# Altium schematic sheet loom-rear-new.SchDoc
size 840 x 594 mm
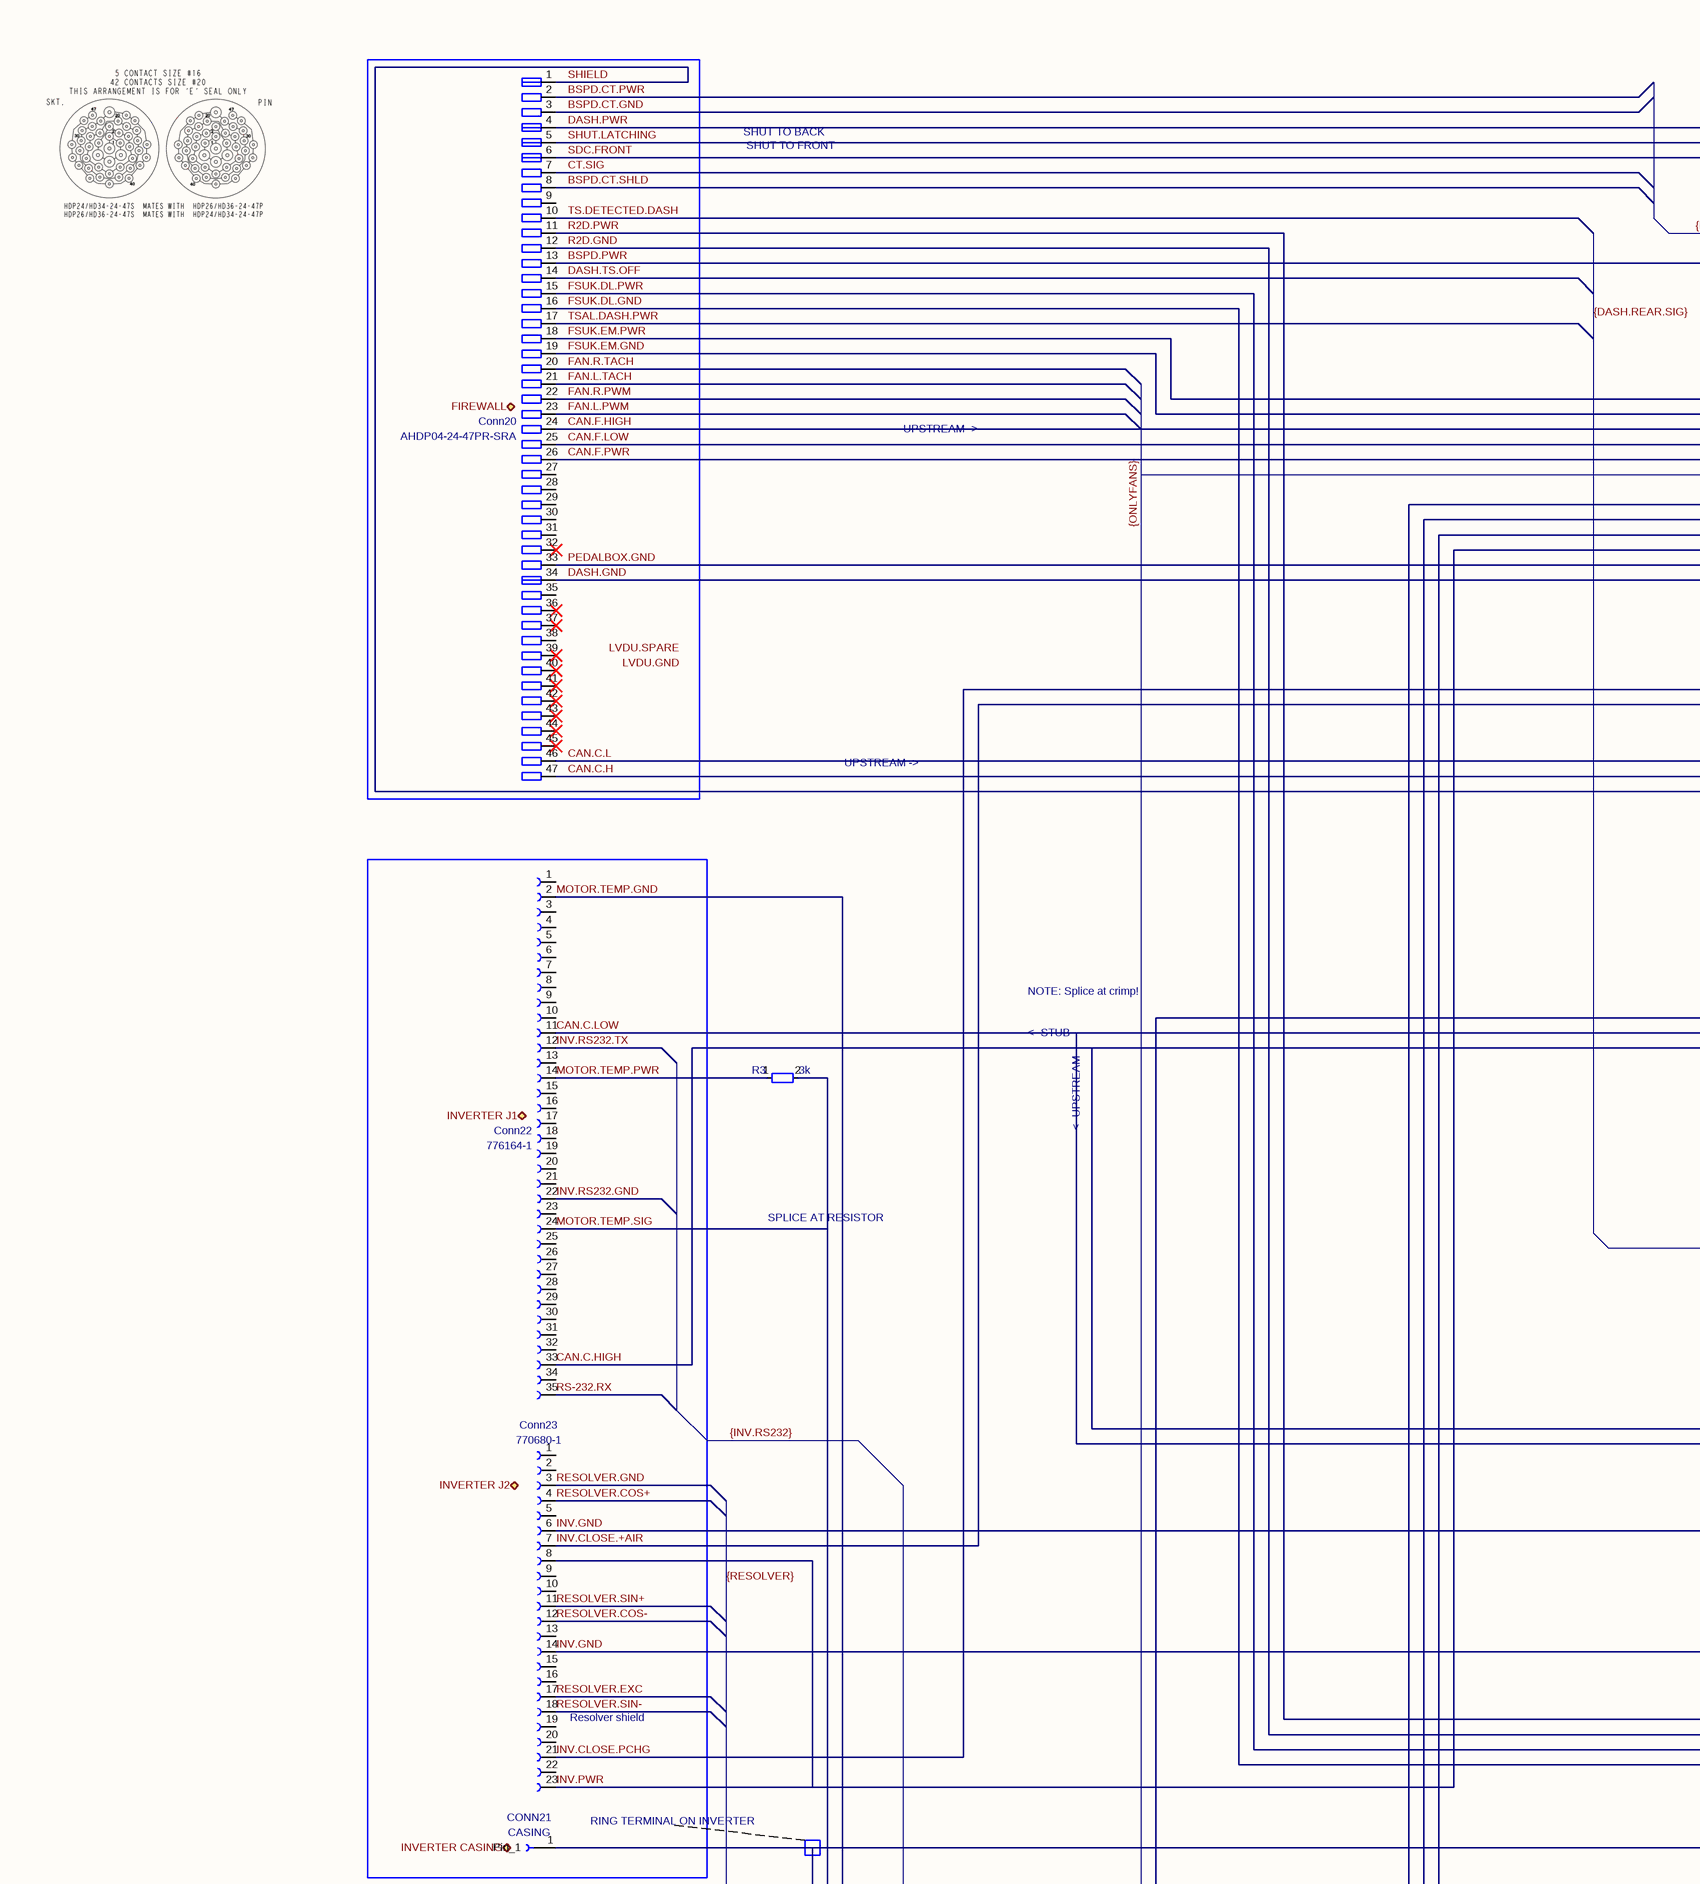
[diagram p0: loom-rear-new.SchDoc, top left]
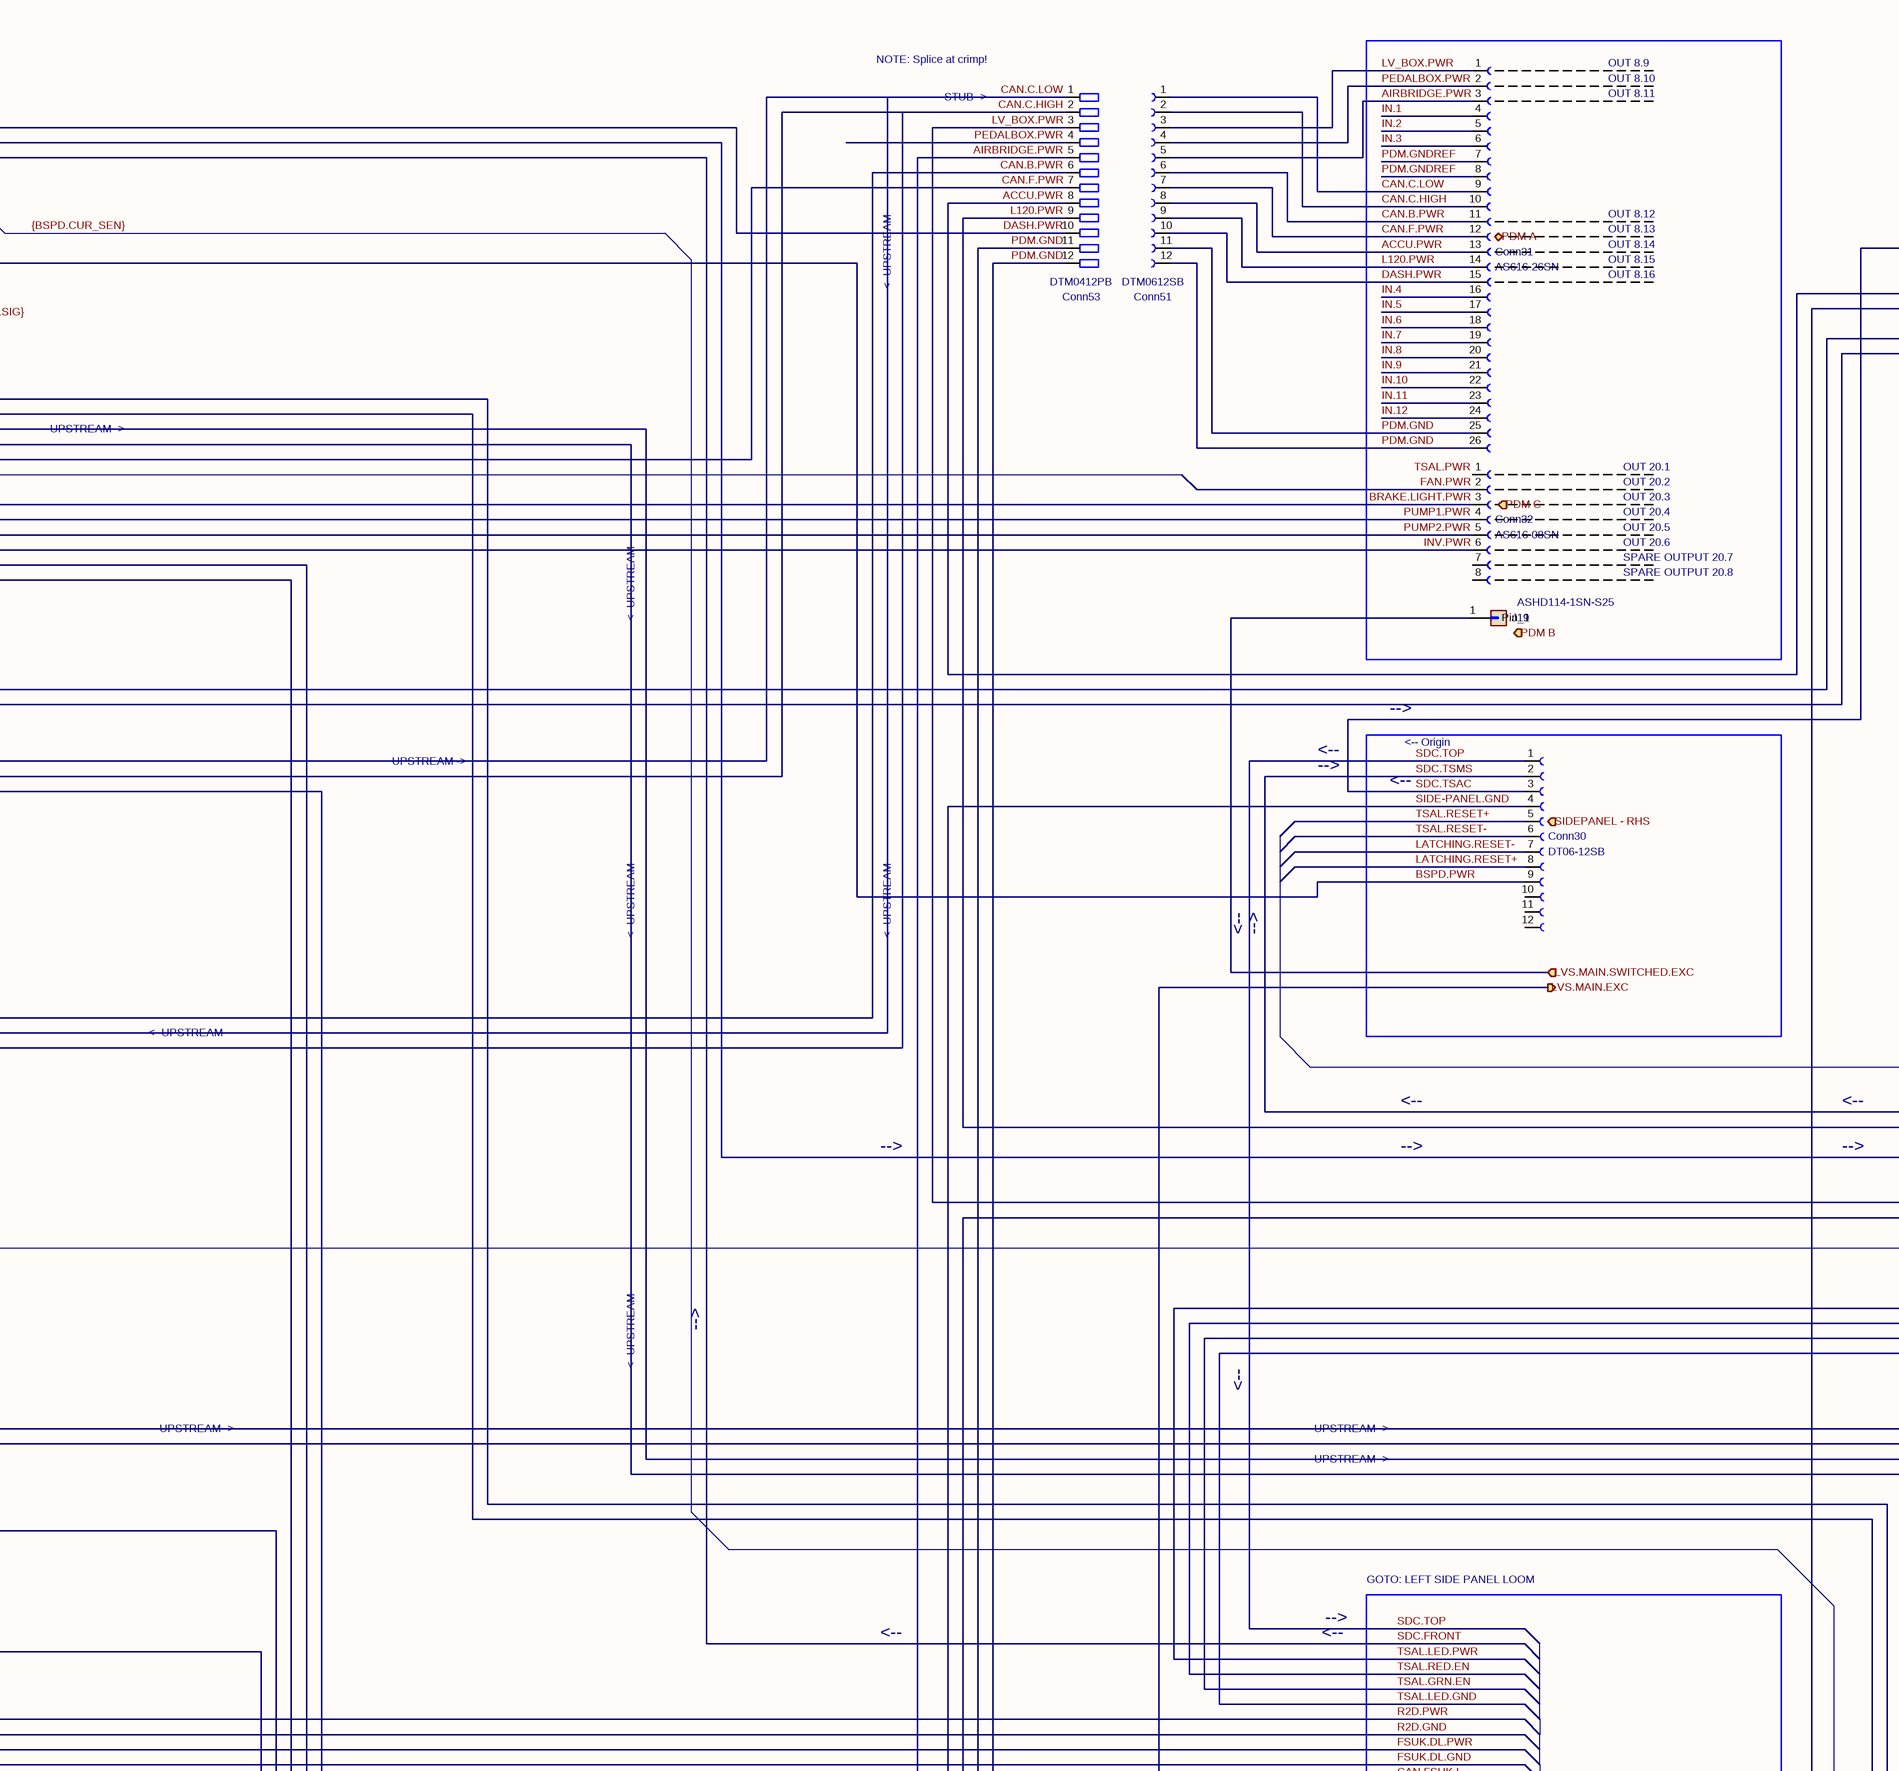
[diagram p1: loom-rear-new.SchDoc, top middle]
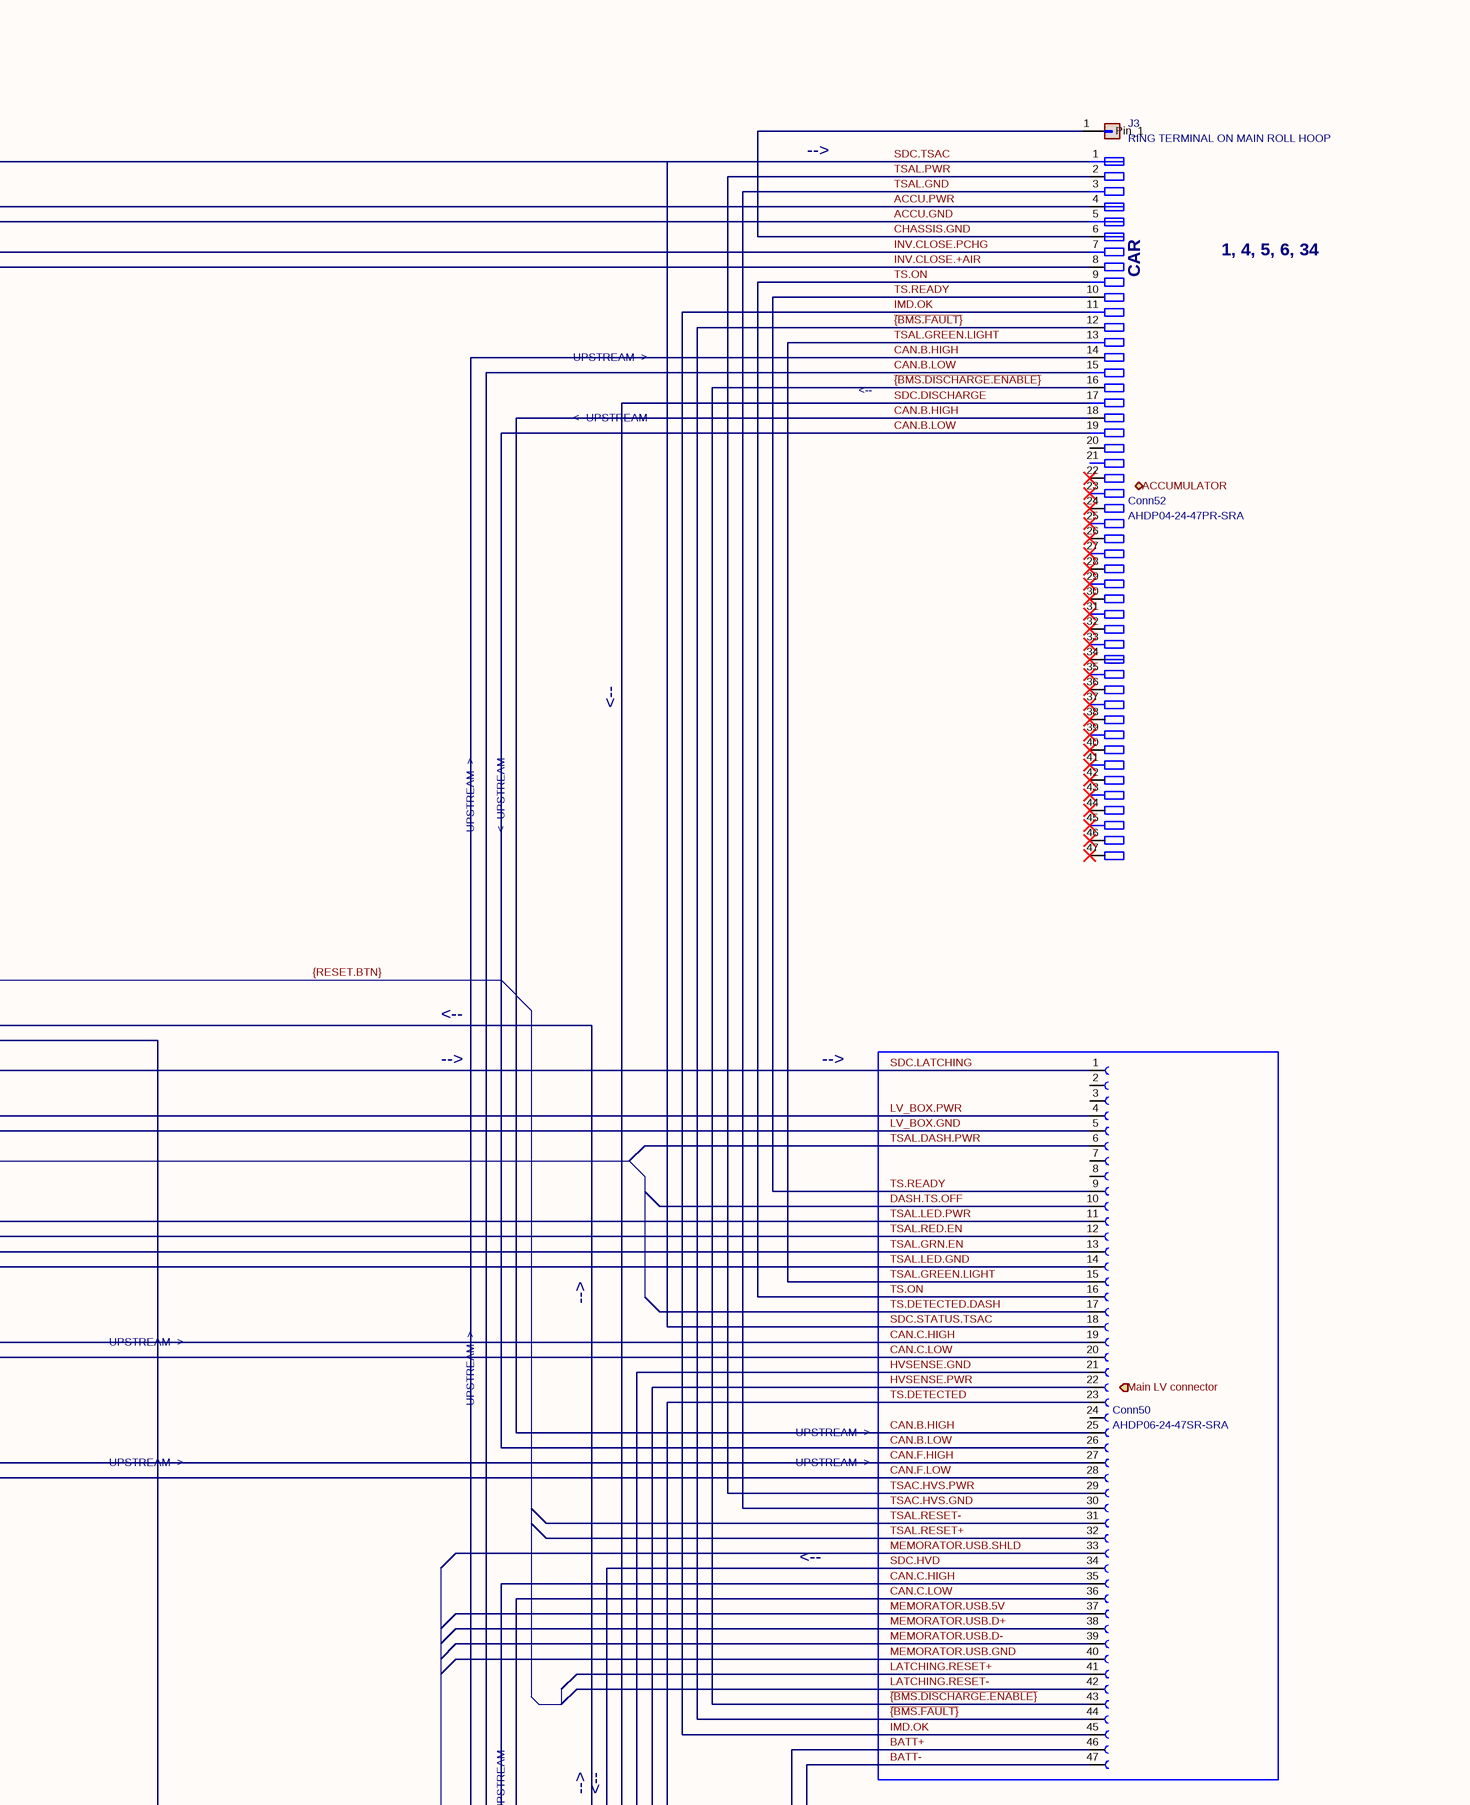
[diagram p2: loom-rear-new.SchDoc, top right]
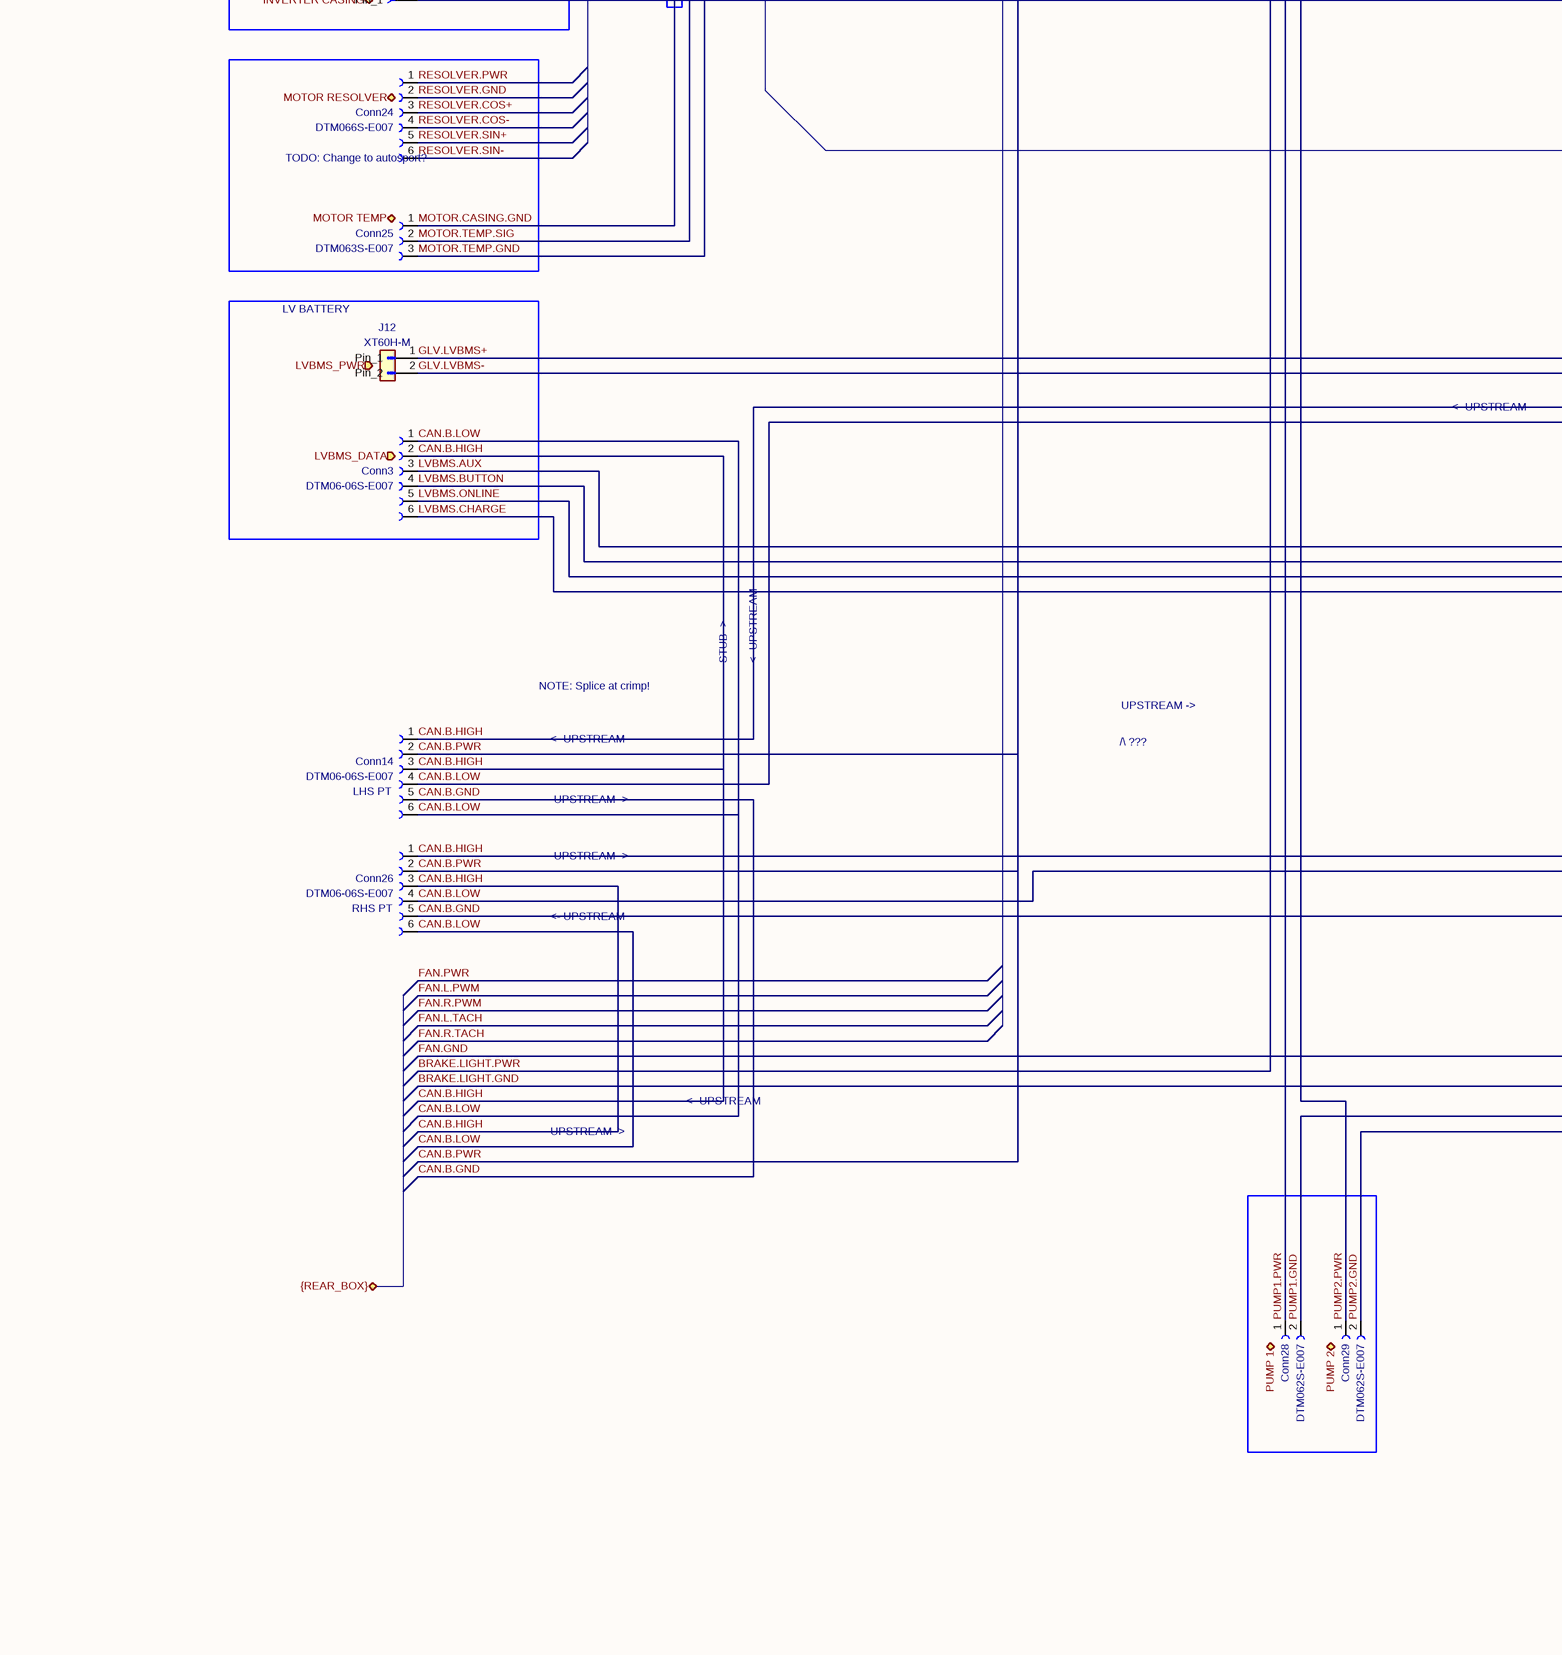
[diagram p3: loom-rear-new.SchDoc, bottom left]
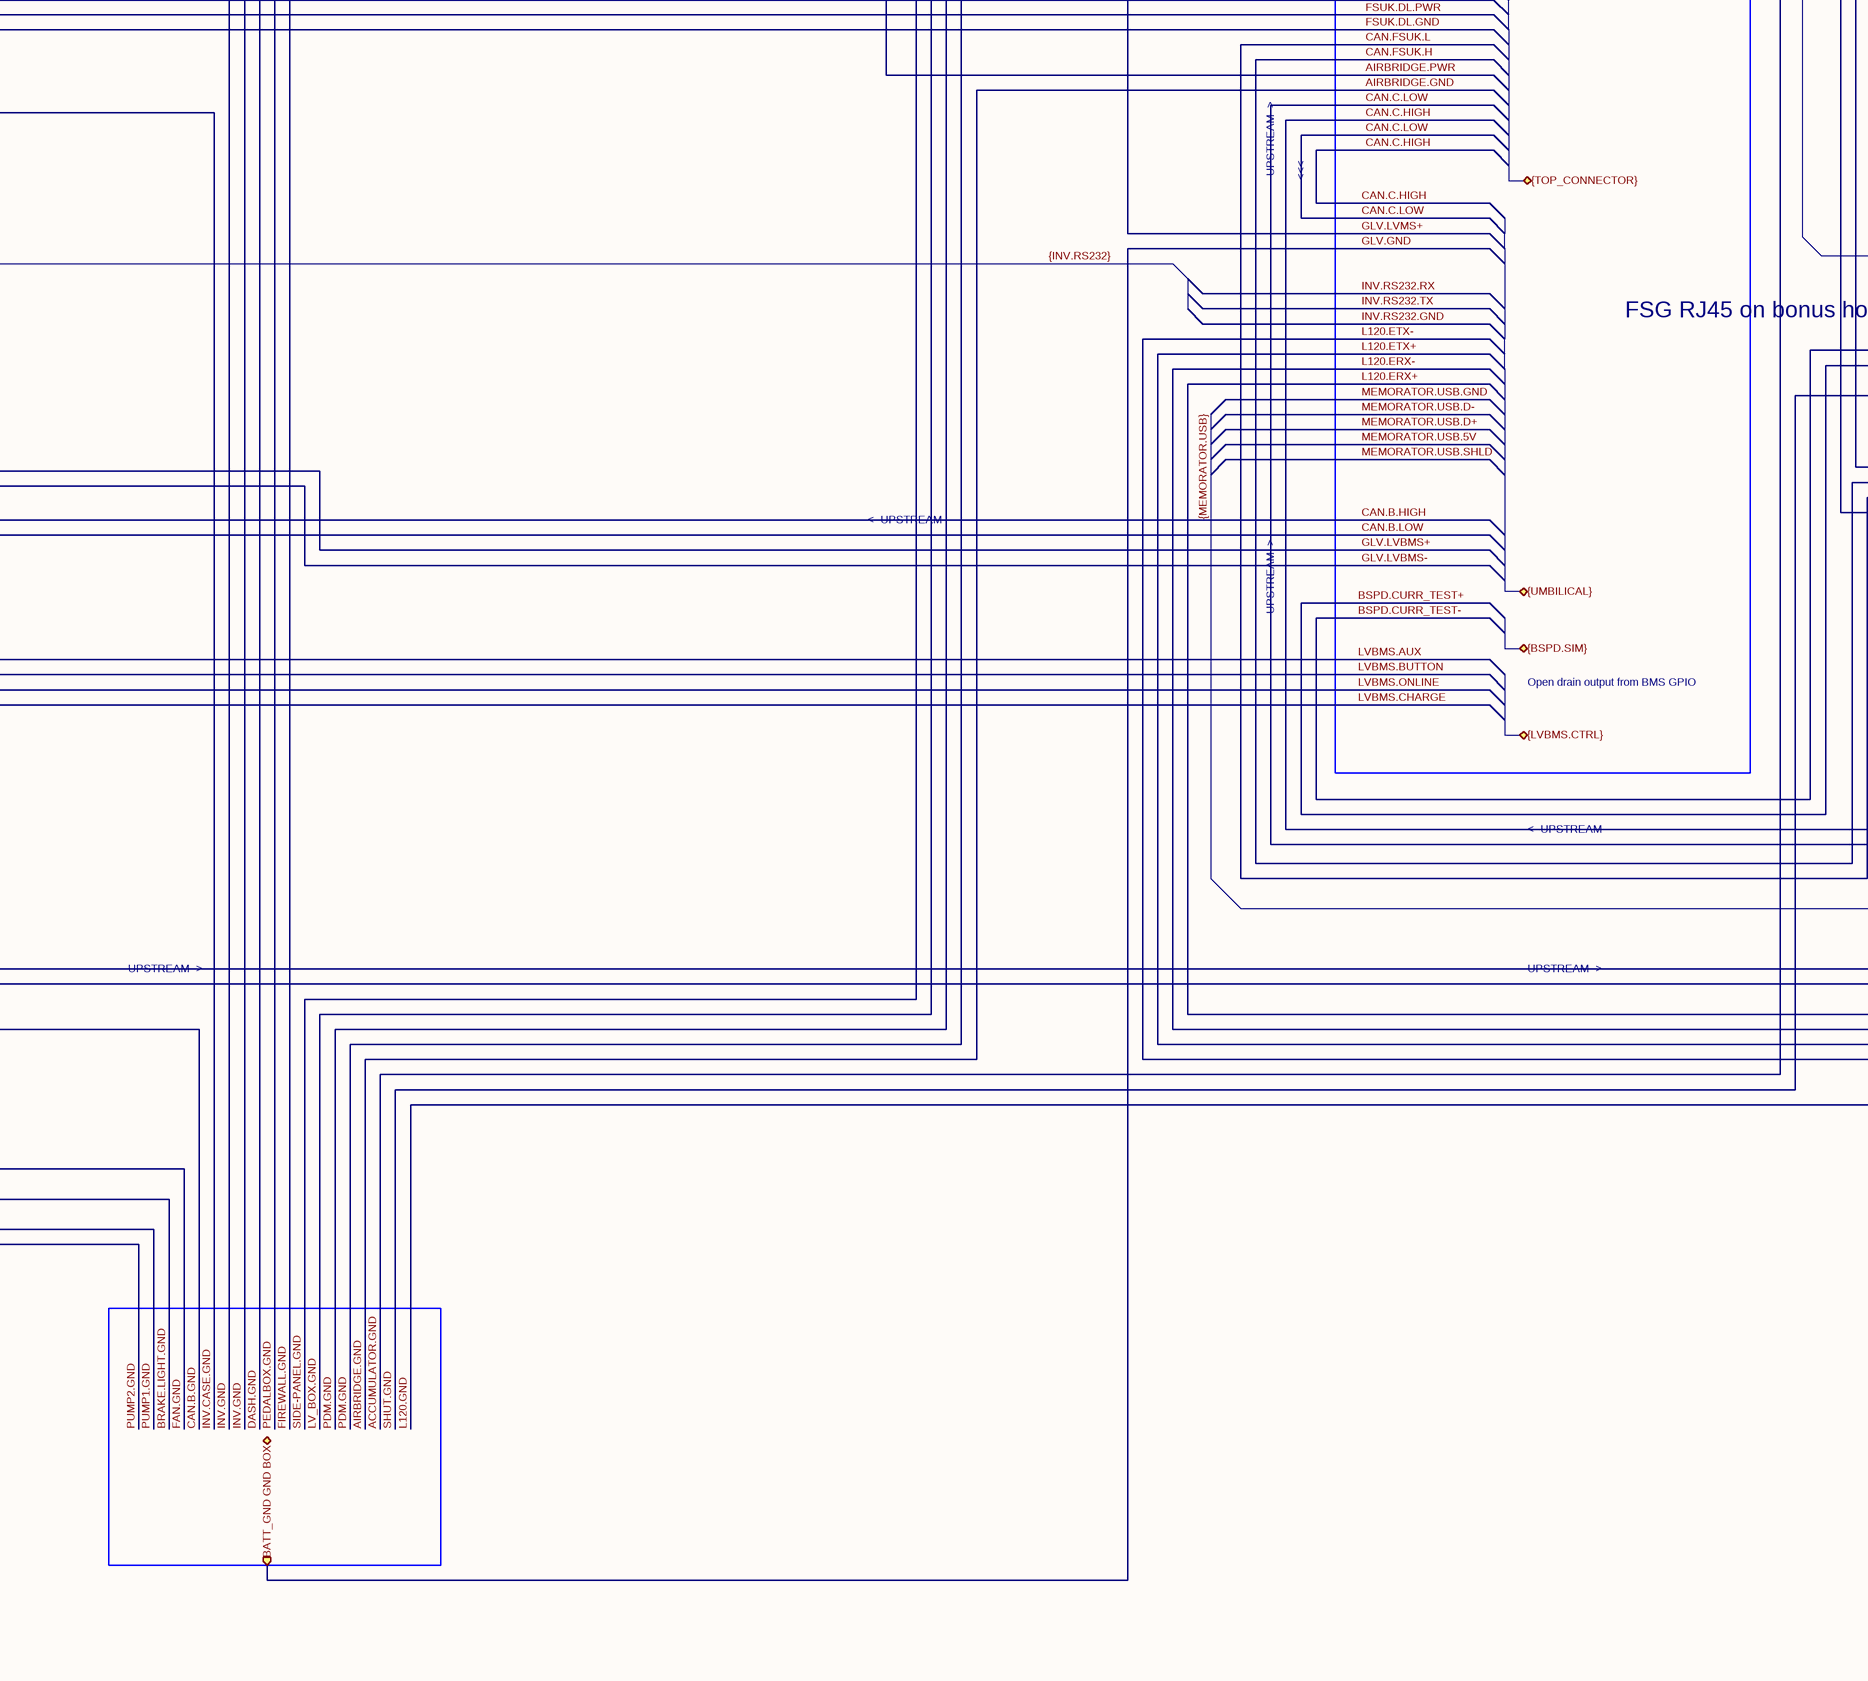
[diagram p4: loom-rear-new.SchDoc, bottom middle]
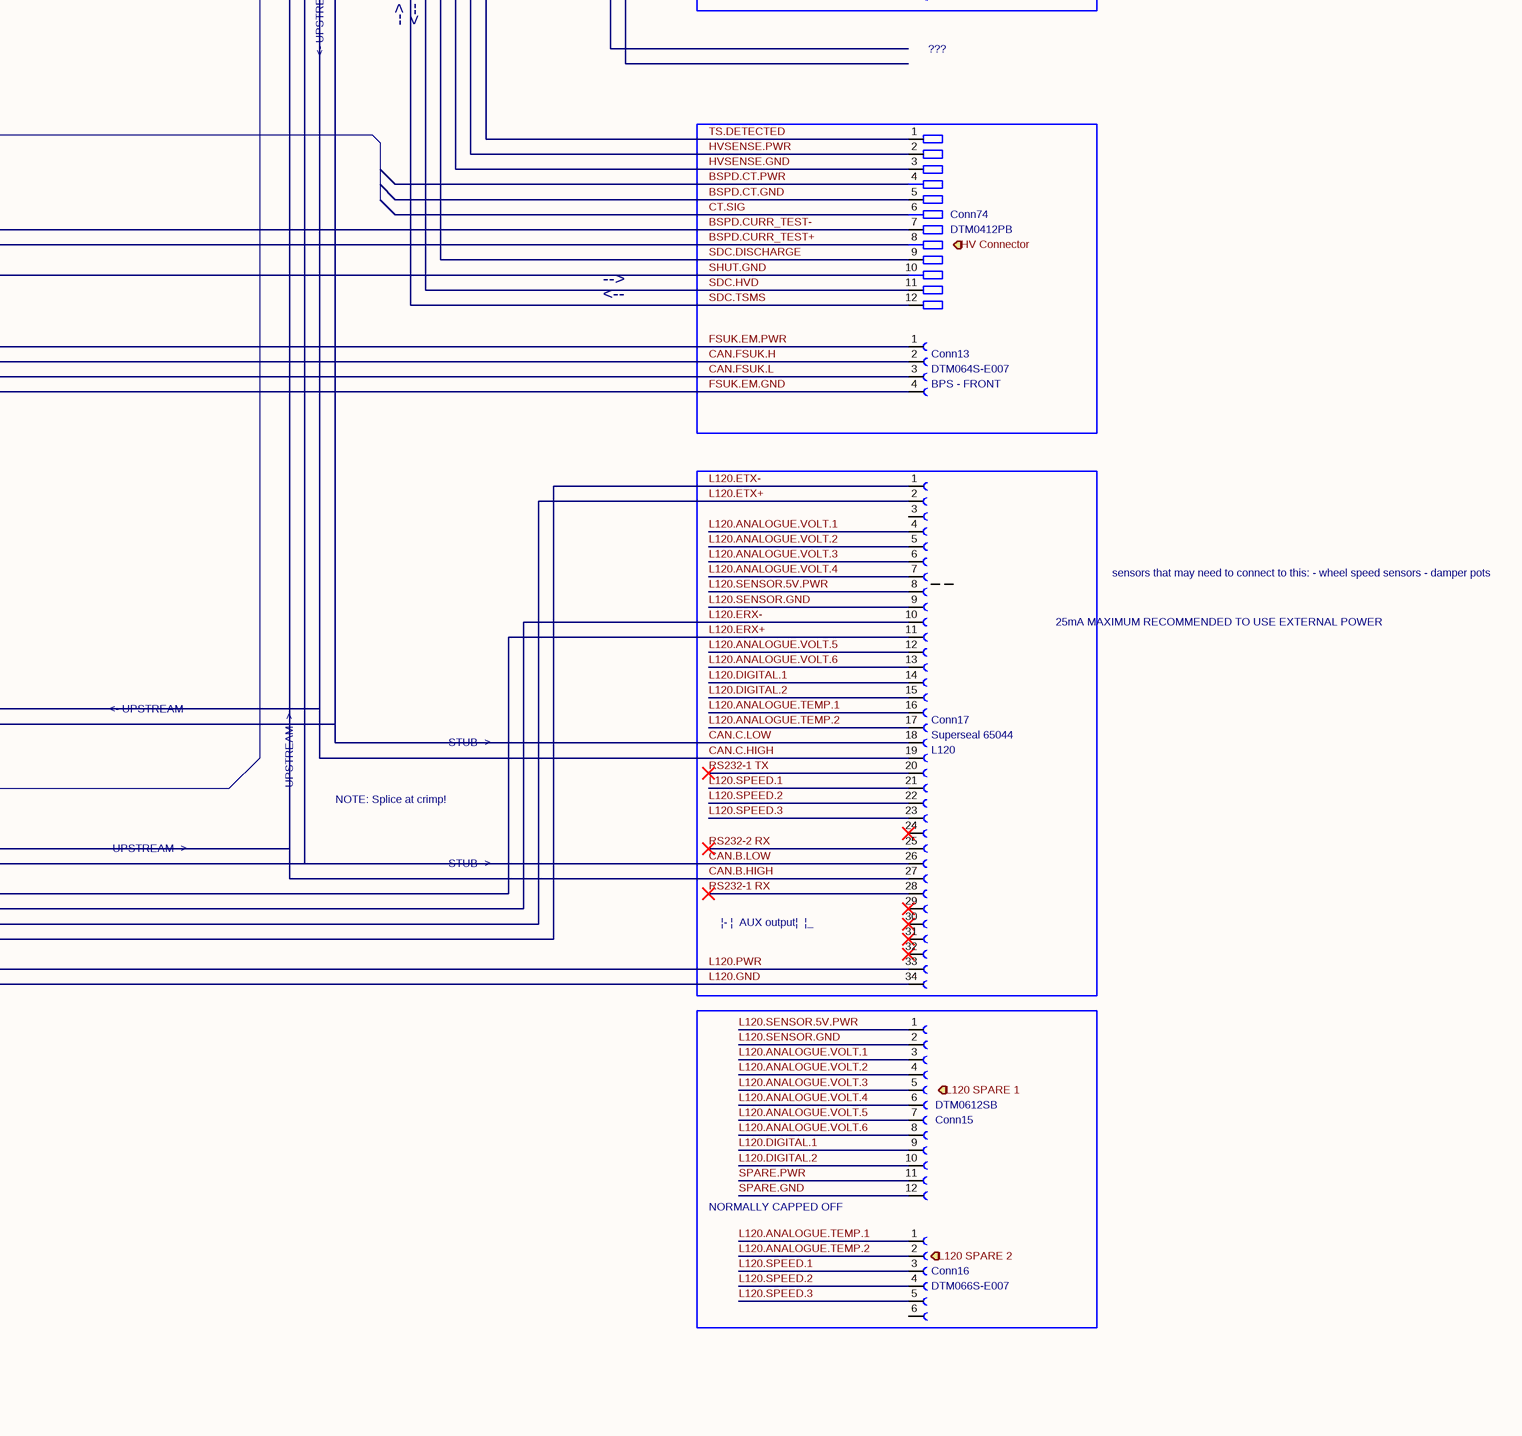
[diagram p5: loom-rear-new.SchDoc, bottom right]

## Parts
Conn3  P/N: DTM06-06S-E007  (hidden comment: Deutsch_DTM_6S_Pin)
Conn13  P/N: DTM064S-E007  Conn Name: BPS - FRONT  (hidden comment: Deutsch_DTM_4S_Pin)
Conn14  P/N: DTM06-06S-E007  Conn Name: LHS PT  (hidden comment: Deutsch_DTM_6S_Pin)
Conn15  P/N: DTM0612SB  (hidden comment: Deutsch_DTM_12S_Pin)
Conn16  P/N: DTM066S-E007  (hidden comment: Deutsch_DTM_6S_Pin)
Conn17  P/N: Superseal 65044  Conn Name: L120  (hidden comment: L120 Connector)
Conn20  P/N: AHDP04-24-47PR-SRA  (hidden comment: AMPHENOL-47P-Pannel)
CONN21  CASING
Conn22  P/N: 776164-1  (hidden comment: J1 Inverter Connector)
Conn23  P/N: 770680-1  (hidden comment: J2 Inverter Connector)
Conn24  P/N: DTM066S-E007  (hidden comment: Deutsch_DTM_6S_Pin)
Conn25  P/N: DTM063S-E007  (hidden comment: Deutsch_DTM_3S_Pin)
Conn26  P/N: DTM06-06S-E007  Conn Name: RHS PT  (hidden comment: Deutsch_DTM_6S_Pin)
Conn28  P/N: DTM062S-E007  (hidden comment: Deutsch_DTM_2S_Pin)
Conn29  P/N: DTM062S-E007  (hidden comment: Deutsch_DTM_2S_Pin)
Conn30  P/N: DT06-12SB  (hidden comment: Deutsch_DTM_12S_Pin)
Conn31  P/N: AS616-26SN  (hidden comment: Conn A PDM Connector)
Conn32  P/N: AS616-08SN  (hidden comment: Conn C PDM Connector)
Conn50  P/N: AHDP06-24-47SR-SRA  (hidden comment: AMPHENOL-47P-Recepticle)
Conn51  P/N: DTM0612SB  (hidden comment: Deutsch_DTM_12S_Pin)
Conn52  P/N: AHDP04-24-47PR-SRA  (hidden comment: AMPHENOL-47P-Pannel)
Conn53  P/N: DTM0412PB  (hidden comment: Deutsch_DTM_12P_Pin)
Conn74  P/N: DTM0412PB  (hidden comment: Deutsch_DTM_12P_Pin)
J3  RING TERMINAL ON MAIN ROLL HOOP
J12  XT60H-M
J19  ASHD114-1SN-S25
R3  3k

## Blocks framed on the sheet
TODO: Change to / autosport?: Conn24 Conn25
LV BATTERY: Conn3 J12
NORMALLY CAPPED OFF: Conn15 Conn16

## Ports
ACCUMULATOR (bidir), BATT_GND (in), FIREWALL (bidir), GND BOX (bidir), HV Connector (in), INVERTER CASING (bidir), INVERTER J1 (bidir), INVERTER J2 (bidir), L120 SPARE 1 (in), L120 SPARE 2 (in), LVBMS_DATA (in), LVBMS_PWR (in), LVS.MAIN.EXC (out), LVS.MAIN.SWITCHED.EXC (in), Main LV connector (in), MOTOR RESOLVER (bidir), MOTOR TEMP (bidir), PDM A (bidir), PDM B (out), PDM C (in), PUMP 1 (bidir), PUMP 2 (bidir), SIDEPANEL - RHS (in), {BSPD.SIM} (bidir), {LVBMS.CTRL} (bidir), {REAR_BOX} (bidir), {TOP_CONNECTOR} (bidir), {UMBILICAL} (bidir)

## Nets
ACCU.GND: Conn52.5  [also labelled ACCUMULATOR.GND]
ACCU.PWR: Conn31.13 Conn51.8 Conn52.4 Conn53.8
AIRBRIDGE.PWR: Conn31.3 Conn51.5 Conn53.5
BATT+: Conn50.46
BATT-: Conn50.47
BRAKE.LIGHT.PWR: Conn32.3
BSPD.CT.GND: Conn20.3 Conn74.5
BSPD.CT.PWR: Conn20.2 Conn74.4
BSPD.CT.SHLD: Conn20.8
BSPD.CURR_TEST+: Conn74.8
BSPD.CURR_TEST-: Conn74.7
BSPD.PWR: Conn20.13 Conn30.9
CAN.B.GND: Conn14.5 Conn26.5
CAN.B.HIGH: Conn3.2 Conn14.1 Conn14.3 Conn17.27 Conn26.1 Conn26.3 Conn50.25 Conn52.14 Conn52.18  [also labelled {MEMORATOR.USB}]
CAN.B.LOW: Conn3.1 Conn14.4 Conn14.6 Conn17.26 Conn26.4 Conn26.6 Conn50.26 Conn52.15 Conn52.19
CAN.B.PWR: Conn14.2 Conn26.2 Conn31.11 Conn51.6 Conn53.6
CAN.C.H: Conn17.19 Conn20.47 Conn22.33 Conn31.10 Conn50.19 Conn50.35 Conn51.2 Conn53.2  [also labelled CAN.C.HIGH]
CAN.C.L: Conn17.18 Conn20.46 Conn22.11 Conn31.9 Conn50.20 Conn50.36 Conn51.1 Conn53.1  [also labelled CAN.C.LOW]
CAN.F.HIGH: Conn20.23 Conn20.24 Conn50.27  [also labelled FAN.L.PWM]
CAN.F.LOW: Conn20.25 Conn50.28
CAN.F.PWR: Conn20.26 Conn31.12 Conn51.7 Conn53.7
CAN.FSUK.H: Conn13.2
CAN.FSUK.L: Conn13.3
CHASSIS.GND: Conn52.6 J3.1(Pin_1)
CT.SIG: Conn20.7 Conn74.6
DASH.GND: Conn20.34
DASH.PWR: Conn20.4 Conn31.15 Conn51.10 Conn53.10
DASH.TS.OFF: Conn20.14 Conn50.10
FAN.L.TACH: Conn20.21
FAN.PWR: Conn32.2
FAN.R.PWM: Conn20.22
FAN.R.TACH: Conn20.20
FIREWALL.GND: Conn20.1  [also labelled SHIELD]
FSUK.DL.GND: Conn20.16
FSUK.DL.PWR: Conn20.15
FSUK.EM.GND: Conn13.4 Conn20.19
FSUK.EM.PWR: Conn13.1 Conn20.18
GLV.GND: port BATT_GND
GLV.LVBMS+: J12.1(Pin_1)
GLV.LVBMS-: J12.2(Pin_2)
GLV.LVMS+: port LVS.MAIN.EXC
HVSENSE.GND: Conn50.21 Conn74.3
HVSENSE.PWR: Conn50.22 Conn74.2
IMD.OK: Conn50.45 Conn52.11
IN.1: Conn31.4
IN.2: Conn31.5
IN.3: Conn31.6
IN.4: Conn31.16
IN.5: Conn31.17
IN.6: Conn31.18
IN.7: Conn31.19
IN.8: Conn31.20
IN.9: Conn31.21
IN.10: Conn31.22
IN.11: Conn31.23
IN.12: Conn31.24
INV.CASE.GND: CONN21.1(Pin_1) Conn25.1  [also labelled MOTOR.CASING.GND]
INV.CLOSE.+AIR: Conn23.7 Conn52.8
INV.CLOSE.PCHG: Conn23.21 Conn52.7
INV.GND: Conn23.6 Conn23.14
INV.PWR: Conn23.8 Conn23.23 Conn32.6
INV.RS232.GND: Conn22.22
INV.RS232.TX: Conn22.12
L120.ANALOGUE.TEMP.1: Conn16.1 Conn17.16
L120.ANALOGUE.TEMP.2: Conn16.2 Conn17.17
L120.ANALOGUE.VOLT.1: Conn15.3 Conn17.4
L120.ANALOGUE.VOLT.2: Conn15.4 Conn17.5
L120.ANALOGUE.VOLT.3: Conn15.5 Conn17.6
L120.ANALOGUE.VOLT.4: Conn15.6 Conn17.7
L120.ANALOGUE.VOLT.5: Conn15.7 Conn17.12
L120.ANALOGUE.VOLT.6: Conn15.8 Conn17.13
L120.DIGITAL.1: Conn15.9 Conn17.14
L120.DIGITAL.2: Conn15.10 Conn17.15
L120.ERX+: Conn17.11
L120.ERX-: Conn17.10
L120.ETX+: Conn17.2
L120.ETX-: Conn17.1
L120.GND: Conn17.34
L120.PWR: Conn17.33 Conn31.14 Conn51.9 Conn53.9
L120.SENSOR.5V.PWR: Conn15.1 Conn17.8
L120.SENSOR.GND: Conn15.2 Conn17.9
L120.SPEED.1: Conn16.3 Conn17.21
L120.SPEED.2: Conn16.4 Conn17.22
L120.SPEED.3: Conn16.5 Conn17.23
LATCHING.RESET+: Conn30.8 Conn50.41
LATCHING.RESET-: Conn30.7 Conn50.42
LV_BOX.GND: Conn50.5
LV_BOX.PWR: Conn31.1 Conn50.4 Conn51.3 Conn53.3
LVBMS.AUX: Conn3.3
LVBMS.BUTTON: Conn3.4
LVBMS.CHARGE: Conn3.6
LVBMS.ONLINE: Conn3.5
LVS.MAIN.SWITCHED.EXC: J19.1(Pin_1) ; port LVS.MAIN.SWITCHED.EXC
MEMORATOR.USB.5V: Conn50.37
MEMORATOR.USB.D+: Conn50.38
MEMORATOR.USB.D-: Conn50.39
MEMORATOR.USB.GND: Conn50.40
MEMORATOR.USB.SHLD: Conn50.33
MOTOR.TEMP.GND: Conn22.2 Conn25.3
MOTOR.TEMP.PWR: Conn22.14 R3.1
MOTOR.TEMP.SIG: Conn22.24 Conn25.2 R3.2
PDM.GND: Conn31.25 Conn31.26 Conn51.11 Conn51.12 Conn53.11 Conn53.12
PDM.GNDREF: Conn31.7 Conn31.8
PEDALBOX.GND: Conn20.33
PEDALBOX.PWR: Conn31.2 Conn51.4 Conn53.4
PUMP1.GND: Conn28.2
PUMP1.PWR: Conn28.1 Conn32.4
PUMP2.GND: Conn29.2
PUMP2.PWR: Conn29.1 Conn32.5
R2D.GND: Conn20.12
R2D.PWR: Conn20.11
RESOLVER.COS+: Conn23.4 Conn24.3
RESOLVER.COS-: Conn23.12 Conn24.4
RESOLVER.EXC: Conn23.17
RESOLVER.GND: Conn23.3 Conn24.2
RESOLVER.PWR: Conn24.1
RESOLVER.SIN+: Conn23.11 Conn24.5
RESOLVER.SIN-: Conn23.18 Conn24.6
RS232-1 RX: Conn17.28
RS232-1 TX: Conn17.20
RS232-2 RX: Conn17.25
RS-232.RX: Conn22.35
SDC.DISCHARGE: Conn52.17 Conn74.9
SDC.FRONT: Conn20.6
SDC.HVD: Conn50.34 Conn74.11
SDC.LATCHING: Conn20.5 Conn50.1  [also labelled SHUT.LATCHING]
SDC.STATUS.TSAC: Conn30.3 Conn50.18 Conn52.1  [also labelled SDC.TSAC]
SDC.TOP: Conn30.1
SDC.TSMS: Conn30.2 Conn74.12
SHUT.GND: Conn74.10
SIDE-PANEL.GND: Conn30.4
SPARE.GND: Conn15.12
SPARE.PWR: Conn15.11
TS.DETECTED: Conn50.23 Conn74.1
TS.DETECTED.DASH: Conn20.10 Conn50.17
TS.ON: Conn50.16 Conn52.9
TS.READY: Conn50.9 Conn52.10
TSAC.HVS.GND: Conn50.30 Conn52.3  [also labelled TSAL.GND]
TSAC.HVS.PWR: Conn32.1 Conn50.29 Conn52.2  [also labelled TSAL.PWR]
TSAL.DASH.PWR: Conn20.17 Conn50.6
TSAL.GREEN.LIGHT: Conn50.15 Conn52.13
TSAL.GRN.EN: Conn50.13
TSAL.LED.GND: Conn50.14
TSAL.LED.PWR: Conn50.11
TSAL.RED.EN: Conn50.12
TSAL.RESET+: Conn30.5 Conn50.32
TSAL.RESET-: Conn30.6 Conn50.31
~{{BMS.DISCHARGE.ENABLE}}: Conn50.43 Conn52.16
~{{BMS.FAULT}}: Conn50.44 Conn52.12

Not connected (* = marked no-connect by the designer): Conn16 6; Conn17 3 24* 29* 30* 31* 32*; Conn20 9 27 28 29 30 31 32* 35 36* 37* 38 39* 40* 41* 42* 43* 44* 45*; Conn22 1 3 4 5 6 7 8 9 10 13 15 16 17 18 19 20 21 23 25 26 27 28 29 30 31 32 34; Conn23 1 2 5 9 10 13 15 16 19 20 22; Conn30 10 11 12; Conn32 7 8; Conn50 2 3 7 8 24; Conn52 20 21 22* 23* 24* 25* 26* 27* 28* 29* 30* 31* 32* 33* 34* 35* 36* 37* 38* 39* 40* 41* 42* 43* 44* 45* 46* 47*

## Buses and harness runs
bus {BSPD.CUR_SEN}
bus {DASH.REAR.SIG}
bus {INV.RS232}
bus {ONLYFANS}
bus {RESET.BTN}
bus {RESOLVER}

## Notes on the sheet
- NOTE: Splice
  at crimp!
- OUT 8.10
- OUT 8.9
- OUT 8.11
- SHUT TO BACK
- SHUT TO FRONT
- STUB ->
- OUT 8.12
- OUT 8.14
- OUT 8.13
- -->
- <- UPSTREAM
- OUT 8.15
- OUT 8.16
- (near Conn52) CAR
- 1, 4, 5, 6, 34
- UPSTREAM ->
- OUT 20.1
- OUT 20.5
- OUT 20.2
- OUT 20.3
- OUT 20.4
- OUT 20.6
- <--
- SPARE OUTPUT 20.8
- SPARE OUTPUT 20.7
- <-- Origin
- <- STUB
- SPLICE AT
  RESISTOR
- GOTO: LEFT SIDE PANEL LOOM
- (near Conn23) Resolver shield
- RING TERMINAL
  ON INVERTER
- (near Conn50) ???
- <<<
- FSG RJ45
  on bonus hole
- Open drain
  output from BMS
  GPIO
- sensors that may need to connect to this:
  - wheel speed sensors
  - damper pots
- 25mA MAXIMUM
  RECOMMENDED
  TO USE EXTERNAL
  POWER
- /\
  ???
- |-
  |
  AUX output|
  |_
- Labels drawn without touching a wire or pin: LVDU.GND, LVDU.SPARE
- 1
- 2
- 3
- 4
- 5
- 6
- 7
- 8
- 9
- 10
- 11
- 12
- 13
- 14
- 15
- 16
- A
- B
- C
- D
- E
- F
- G
- H
- I
- J
- K
- Title:  Rear Loom
- File: loom-rear-new.kicad_sch
- Sheet: /
- KiCad E.D.A.  kicad (5.1.4)-1
- Size: A1
- Date: 2025-11-29
- Rev: 1.0
- Id: 1/1

## Library data of the parts
CONN21 = Conn_01x01_Socket: Value: CASING
J3 = Conn_01x01: Value: RING TERMINAL ON MAIN ROLL HOOP
J12 = Conn_01x02: Description: Generic connector, single row, 01x02, script generated (kicad-library-utils/schlib/autogen/connector/); Value: XT60H-M
J19 = Conn_01x01: Description: Generic connector, single row, 01x01, script generated (kicad-library-utils/schlib/autogen/connector/); Value: ASHD114-1SN-S25
R3 = R_Small: Value: 3k
Conn3 Conn14 Conn16 Conn24 Conn26 = Deutsch_DTM_6S_Pin: Value: Deutsch_DTM_6S_Pin
Conn13 = Deutsch_DTM_4S_Pin: Value: Deutsch_DTM_4S_Pin
Conn15 Conn30 Conn51 = Deutsch_DTM_12S_Pin: Value: Deutsch_DTM_12S_Pin
Conn17 = L120 Connector: Value: L120 Connector
Conn20 Conn52 = AMPHENOL-47P-Pannel: Value: AMPHENOL-47P-Pannel
Conn22 = J1 Inverter Connector: Value: J1 Inverter Connector
Conn23 = J2 Inverter Connector: Value: J2 Inverter Connector
Conn25 = Deutsch_DTM_3S_Pin: Value: Deutsch_DTM_3S_Pin
Conn28 Conn29 = Deutsch_DTM_2S_Pin: Value: Deutsch_DTM_2S_Pin
Conn31 = Conn A PDM Connector: Value: Conn A PDM Connector
Conn32 = Conn C PDM Connector: Value: Conn C PDM Connector
Conn50 = AMPHENOL-47P-Recepticle: Value: AMPHENOL-47P-Recepticle
Conn53 Conn74 = Deutsch_DTM_12P_Pin: Value: Deutsch_DTM_12P_Pin